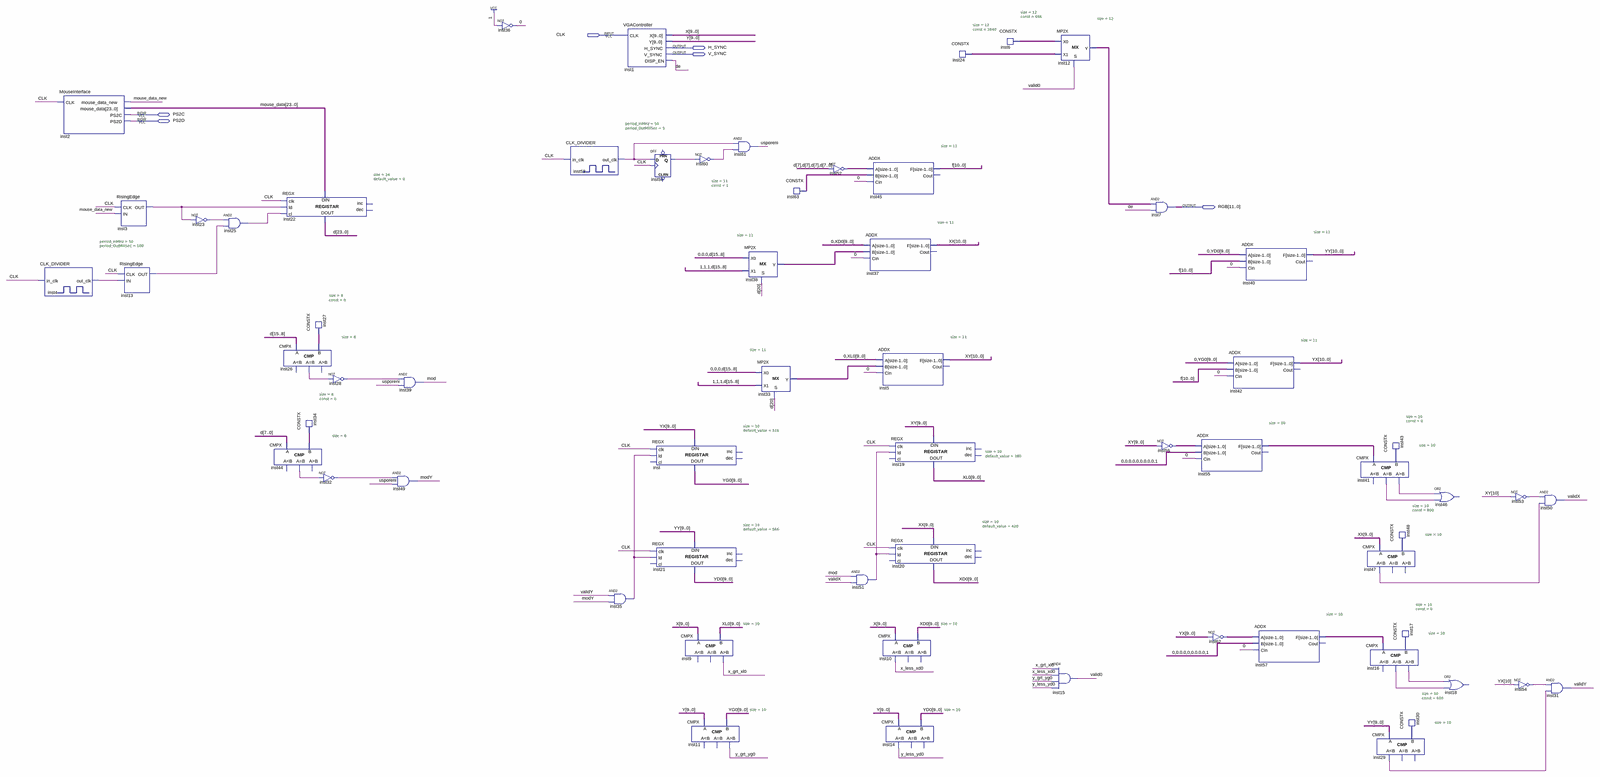
[diagram p0: schematic sheet, whole]
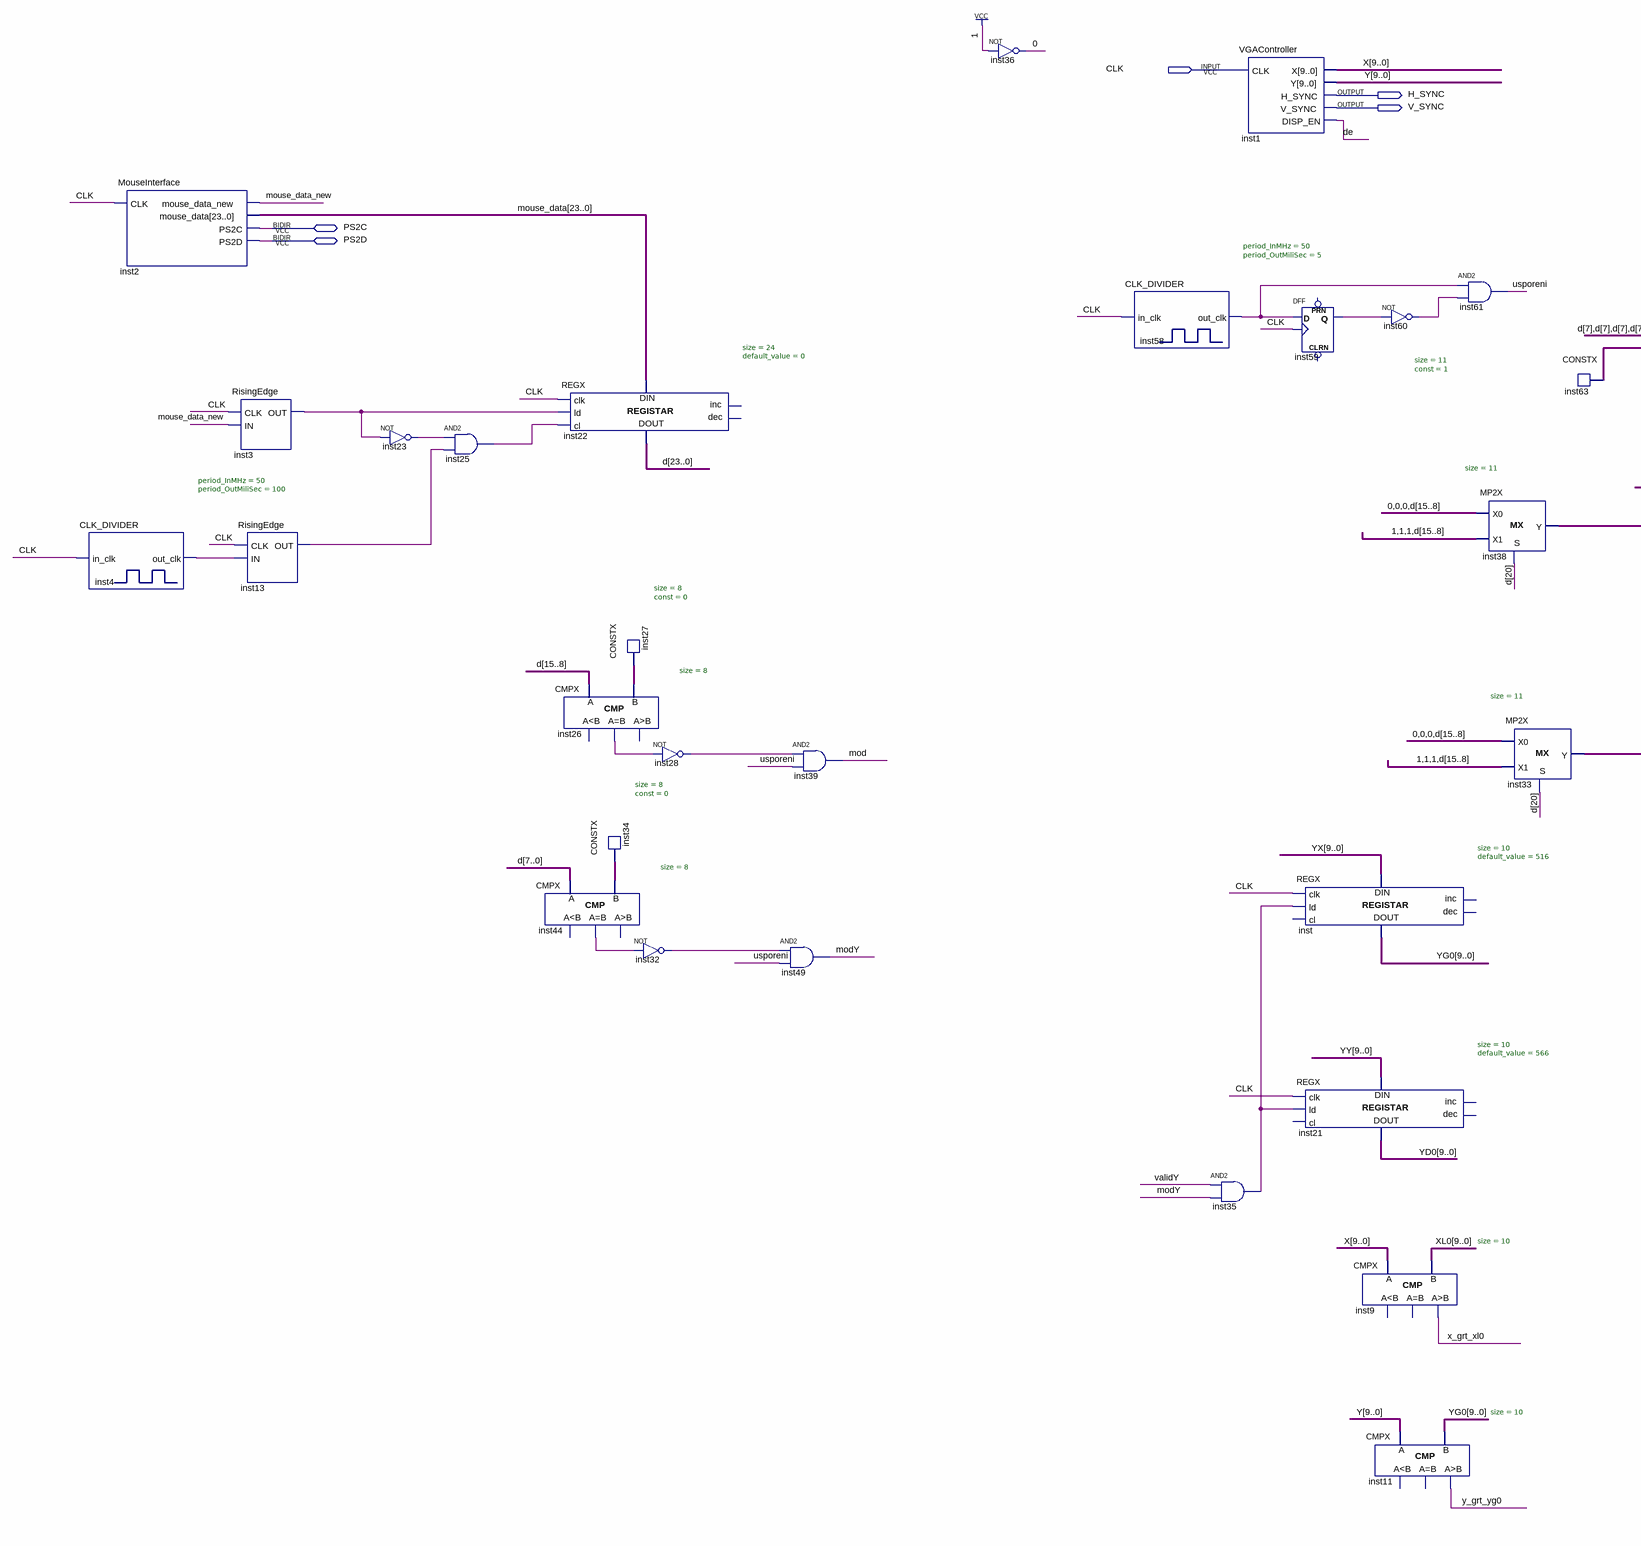
[diagram p1: schematic sheet, left part]
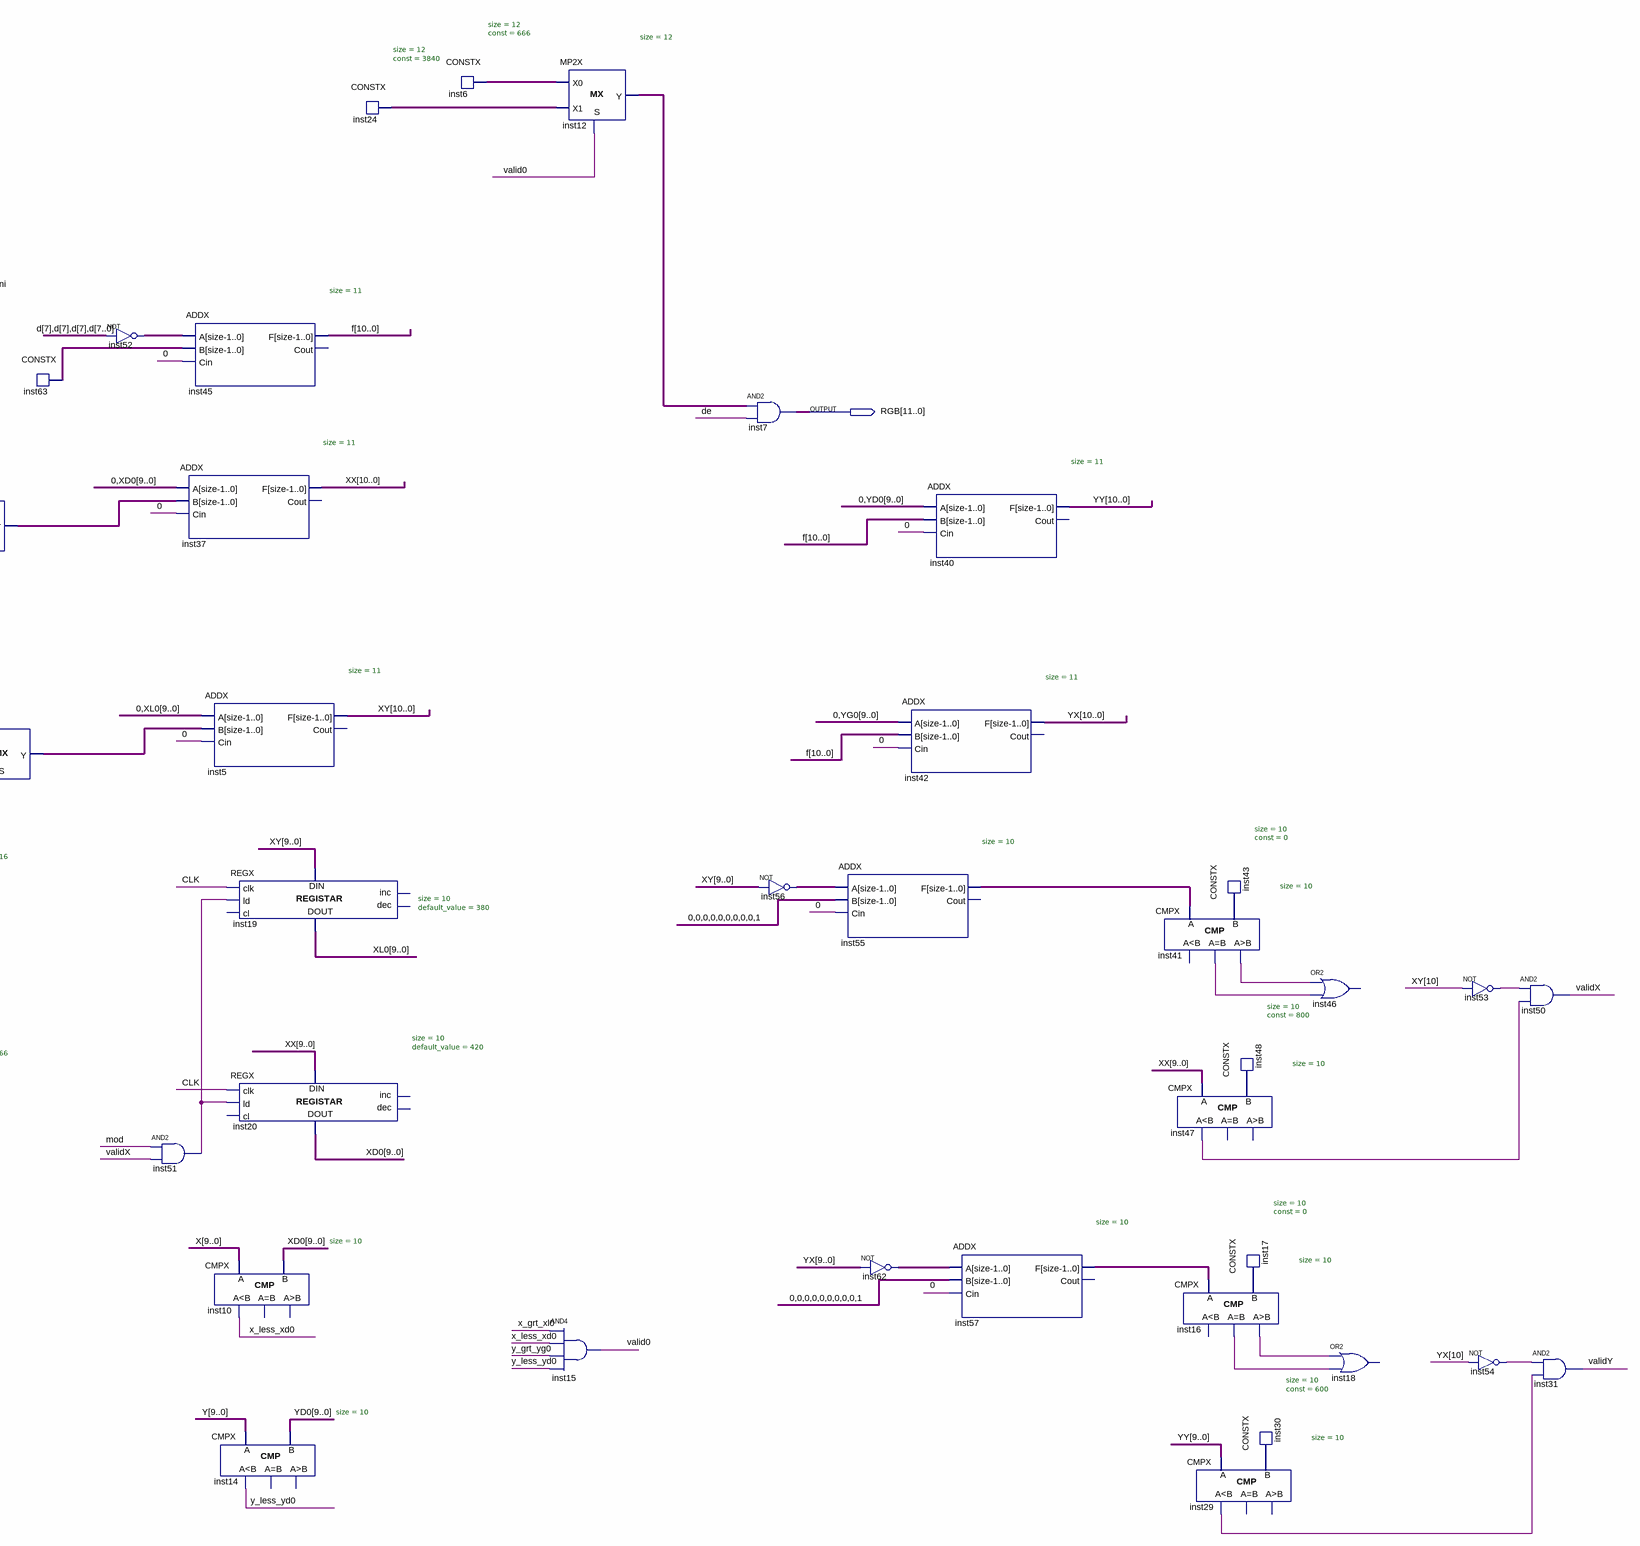
[diagram p2: schematic sheet, right part]
// Quartus schematic brzine.bdf as structural Verilog: 63 symbols, 6 pins
module brzine (
  input  CLK,
  inout  PS2C,
  inout  PS2D,
  output H_SYNC,
  output V_SYNC,
  output [11:0] RGB
);

  wire \0 , de, inst3_out, inst4_out_clk, inst13_out, inst16_eq, inst16_gr, inst23_out, inst25_out,
       inst26_eq, inst28_out, inst29_ls, inst32_out, inst35_out, inst41_eq, inst41_gr, inst44_eq, inst47_ls,
       inst51_out, inst53_out, inst54_out, inst58_out_clk, inst59_q, inst60_out, mod, modY, mouse_data_new,
       usporeni, valid0, validX, validY, x_grt_xl0, x_less_xd0, y_grt_yg0, y_less_yd0;
  wire [7:0] inst27_data, inst34_data;
  wire [9:0] inst17_data, inst30_data, inst43_data, inst48_data, inst55_f, inst56_out, inst57_f, inst62_out,
       X, XD0, XL0, Y, YD0, YG0;
  wire [10:0] f, inst33_y, inst38_y, inst52_out, inst63_data, XX, XY, YX, YY;
  wire [11:0] inst6_data, inst12_y, inst24_data;
  wire [23:0] d, mouse_data;

  CLK_DIVIDER #(.period_InMHz(50), .period_OutMiliSec(100)) inst4 (.in_clk(CLK), .out_clk(inst4_out_clk));
  MouseInterface inst2 (.CLK(CLK), .mouse_data_new(mouse_data_new), .mouse_data(mouse_data), .PS2C(PS2C), .PS2D(PS2D));
  RisingEdge inst3 (.CLK(CLK), .IN(mouse_data_new), .OUT(inst3_out));
  RisingEdge inst13 (.CLK(CLK), .IN(inst4_out_clk), .OUT(inst13_out));
  not inst23 (inst23_out, inst3_out);
  and inst25 (inst25_out, inst23_out, inst13_out);
  CMPX #(.size(8)) inst44 (.A(d[7:0]), .B(inst34_data), .eq(inst44_eq));  // open: ls, gr
  REGX #(.size(24), .default_value(0)) inst22 (
    .clk(CLK), .ld(inst3_out), .cl(inst25_out), .data_in(mouse_data), .data_out(d));  // open: inc, dec
  CMPX #(.size(8)) inst26 (.A(d[15:8]), .B(inst27_data), .eq(inst26_eq));  // open: ls, gr
  CONSTX #(.size(8), .\const (0)) inst34 (.data(inst34_data));
  CONSTX #(.size(8), .\const (0)) inst27 (.data(inst27_data));
  not inst32 (inst32_out, inst44_eq);
  not inst28 (inst28_out, inst26_eq);
  and inst39 (mod, inst28_out, usporeni);
  and inst49 (modY, inst32_out, usporeni);
  not inst36 (\0 , 1'b1);
  CLK_DIVIDER #(.period_InMHz(50), .period_OutMiliSec(5)) inst58 (.in_clk(CLK), .out_clk(inst58_out_clk));
  VGAController inst1 (.CLK(CLK), .X(X), .Y(Y), .H_SYNC(H_SYNC), .V_SYNC(V_SYNC), .DISP_EN(de));
  and inst35 (inst35_out, validY, modY);
  DFF inst59 (.CLK(CLK), .D(inst58_out_clk), .Q(inst59_q));  // open: CLRN, PRN
  REGX #(.size(10), .default_value(516)) inst (
    .clk(CLK), .ld(inst35_out), .data_in(YX[9:0]), .data_out(YG0));  // open: cl, inc, dec
  REGX #(.size(10), .default_value(566)) inst21 (
    .clk(CLK), .ld(inst35_out), .data_in(YY[9:0]), .data_out(YD0));  // open: cl, inc, dec
  CMPX #(.size(10)) inst9 (.A(X), .B(XL0), .gr(x_grt_xl0));  // open: ls, eq
  not inst60 (inst60_out, inst59_q);
  CMPX #(.size(10)) inst11 (.A(Y), .B(YG0), .gr(y_grt_yg0));  // open: ls, eq
  and inst61 (usporeni, inst58_out_clk, inst60_out);
  MP2X #(.size(11)) inst38 (.S(d[20]), .X0({{3{\0 }}, d[15:8]}), .X1({3'b111, d[15:8]}), .Y(inst38_y));
  MP2X #(.size(11)) inst33 (.S(d[20]), .X0({{3{\0 }}, d[15:8]}), .X1({3'b111, d[15:8]}), .Y(inst33_y));
  CONSTX #(.size(11), .\const (1)) inst63 (.data(inst63_data));
  assign inst52_out = ~{{4{d[7]}}, d[6:0]};  // NOT inst52, 11 bits wide
  and inst51 (inst51_out, mod, validX);
  ADDX #(.size(11)) inst45 (.A(inst52_out), .B(inst63_data), .Cin(\0 ), .F(f));  // open: Cout
  ADDX #(.size(11)) inst37 (.A({\0 , XD0}), .B(inst38_y), .Cin(\0 ), .F(XX));  // open: Cout
  ADDX #(.size(11)) inst5 (.A({\0 , XL0}), .B(inst33_y), .Cin(\0 ), .F(XY));  // open: Cout
  CMPX #(.size(10)) inst10 (.A(X), .B(XD0), .ls(x_less_xd0));  // open: eq, gr
  CMPX #(.size(10)) inst14 (.A(Y), .B(YD0), .ls(y_less_yd0));  // open: eq, gr
  REGX #(.size(10), .default_value(380)) inst19 (
    .clk(CLK), .ld(inst51_out), .data_in(XY[9:0]), .data_out(XL0));  // open: cl, inc, dec
  REGX #(.size(10), .default_value(420)) inst20 (
    .clk(CLK), .ld(inst51_out), .data_in(XX[9:0]), .data_out(XD0));  // open: cl, inc, dec
  CONSTX #(.size(12), .\const (3840)) inst24 (.data(inst24_data));
  CONSTX #(.size(12), .\const (666)) inst6 (.data(inst6_data));
  MP2X #(.size(12)) inst12 (.S(valid0), .X0(inst6_data), .X1(inst24_data), .Y(inst12_y));
  and inst15 (valid0, x_grt_xl0, x_less_xd0, y_grt_yg0, y_less_yd0);
  assign RGB = inst12_y & {12{de}};  // AND2 inst7, 12 bits wide
  assign inst56_out = ~XY[9:0];  // NOT inst56, 10 bits wide
  ADDX #(.size(10)) inst55 (.A(inst56_out), .B({{9{\0 }}, 1'b1}), .Cin(\0 ), .F(inst55_f));  // open: Cout
  assign inst62_out = ~YX[9:0];  // NOT inst62, 10 bits wide
  ADDX #(.size(11)) inst40 (.A({\0 , YD0}), .B(f), .Cin(\0 ), .F(YY));  // open: Cout
  ADDX #(.size(11)) inst42 (.A({\0 , YG0}), .B(f), .Cin(\0 ), .F(YX));  // open: Cout
  ADDX #(.size(10)) inst57 (.A(inst62_out), .B({{9{\0 }}, 1'b1}), .Cin(\0 ), .F(inst57_f));  // open: Cout
  CMPX #(.size(10)) inst41 (.A(inst55_f), .B(inst43_data), .eq(inst41_eq), .gr(inst41_gr));  // open: ls
  CMPX #(.size(10)) inst47 (.A(XX[9:0]), .B(inst48_data), .ls(inst47_ls));  // open: eq, gr
  CMPX #(.size(10)) inst16 (.A(inst57_f), .B(inst17_data), .eq(inst16_eq), .gr(inst16_gr));  // open: ls
  CMPX #(.size(10)) inst29 (.A(YY[9:0]), .B(inst30_data), .ls(inst29_ls));  // open: eq, gr
  CONSTX #(.size(10), .\const (0)) inst43 (.data(inst43_data));
  CONSTX #(.size(10), .\const (800)) inst48 (.data(inst48_data));
  CONSTX #(.size(10), .\const (0)) inst17 (.data(inst17_data));
  CONSTX #(.size(10), .\const (600)) inst30 (.data(inst30_data));
  // OR2 inst46 has open pins: IN1=inst41_gr, IN2=inst41_eq, OUT=open
  // OR2 inst18 has open pins: IN1=inst16_gr, IN2=inst16_eq, OUT=open
  not inst53 (inst53_out, XY[10]);
  not inst54 (inst54_out, YX[10]);
  and inst50 (validX, inst53_out, inst47_ls);
  and inst31 (validY, inst54_out, inst29_ls);
endmodule
